# Altium schematic sheet Connecteurs.SchDoc
size A4
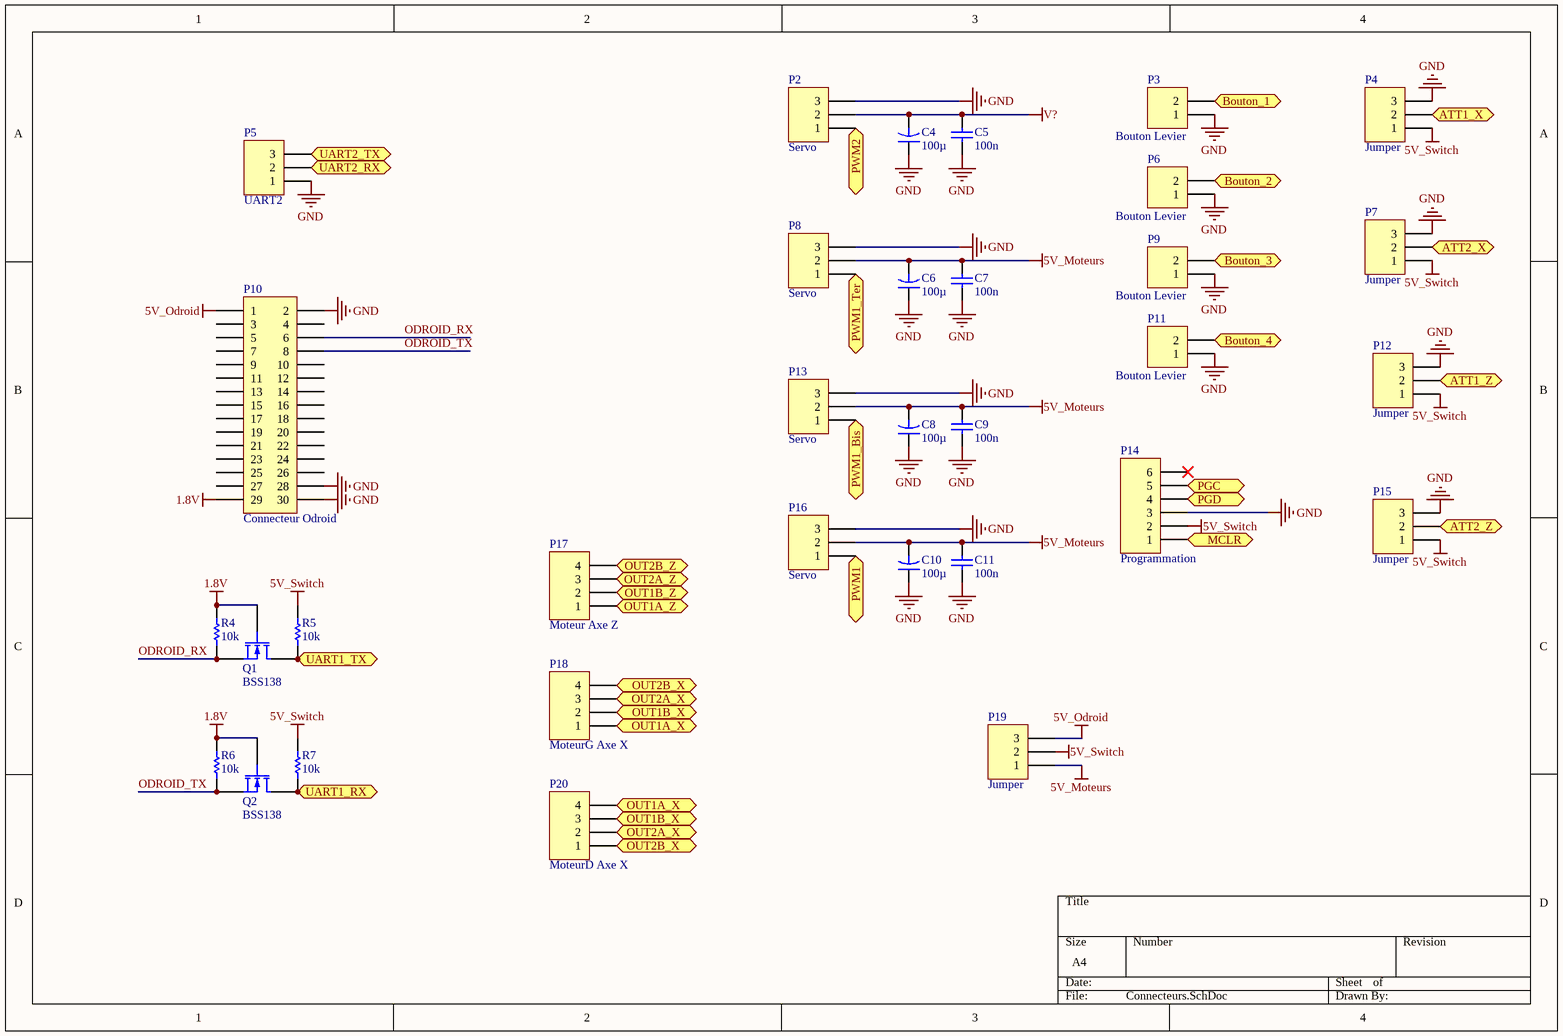
[diagram p0: Connecteurs.SchDoc]

## Parts
C4  value 100µ  [CAPR5-4X5]  (hidden comment: Cap2)
C5  value 100n  [RAD-0.3]  (hidden comment: Cap)
C6  value 100µ  [CAPR5-4X5]  (hidden comment: Cap2)
C7  value 100n  [RAD-0.3]  (hidden comment: Cap)
C8  value 100µ  [CAPR5-4X5]  (hidden comment: Cap2)
C9  value 100n  [RAD-0.3]  (hidden comment: Cap)
C10  value 100µ  [CAPR5-4X5]  (hidden comment: Cap2)
C11  value 100n  [RAD-0.3]  (hidden comment: Cap)
P2  Servo  [HDR1X3]
P3  Bouton Levier  [HDR1X2]
P4  Jumper  [HDR1X3]
P5  UART2  [HDR1X3]
P6  Bouton Levier  [HDR1X2]
P7  Jumper  [HDR1X3]
P8  Servo  [HDR1X3]
P9  Bouton Levier  [HDR1X2]
P10  Connecteur Odroid  [HDR2X15]
P11  Bouton Levier  [HDR1X2]
P12  Jumper  [HDR1X3]
P13  Servo  [HDR1X3]
P14  Programmation  [HDR1X6]
P15  Jumper  [HDR1X3]
P16  Servo  [HDR1X3]
P17  Moteur Axe Z  [HDR1X4]
P18  MoteurG Axe X  [HDR1X4]
P19  Jumper  [HDR1X3]
P20  MoteurD Axe X  [HDR1X4]
Q1  BSS138  [E3]
Q2  BSS138  [E3]
R4  value 10k  [AXIAL-0.3]  (hidden comment: Res1)
R5  value 10k  [AXIAL-0.3]  (hidden comment: Res1)
R6  value 10k  [AXIAL-0.3]  (hidden comment: Res1)
R7  value 10k  [AXIAL-0.3]  (hidden comment: Res1)

## Ports
ATT1_X, ATT1_Z, ATT2_X, ATT2_Z, Bouton_1, Bouton_2, Bouton_3, Bouton_4, MCLR, OUT1A_X, OUT1A_Z, OUT1B_X, OUT1B_Z, OUT2A_X, OUT2A_Z, OUT2B_X, OUT2B_Z, PGC, PGD, PWM1, PWM1_Bis, PWM1_Ter, PWM2, UART1_RX, UART1_TX, UART2_RX, UART2_TX

## Nets
1.8V: P10.29 Q1.2(G) Q2.2(G) R4.1 R6.1
5V_Moteurs: C6.2 C7.1 C8.2 C9.1 C10.2 C11.1 P8.2 P13.2 P16.2 P19.1
5V_Odroid: P10.1 P19.3
5V_Switch: P4.1 P7.1 P12.1 P14.2 P15.1 P19.2 R5.1 R7.1
GND: C4.1 C5.2 C6.1 C7.2 C8.1 C9.2 C10.1 C11.2 P2.3 P3.1 P4.3 P5.1 P6.1 P7.3 P8.3 P9.1 P10.2 P10.28 P10.30 P11.1 P12.3 P13.3 P14.3 P15.3 P16.3
V?: C4.2 C5.1 P2.2
ATT1_X: P4.2 ; port ATT1_X
ATT1_Z: P12.2 ; port ATT1_Z
ATT2_X: P7.2 ; port ATT2_X
ATT2_Z: P15.2 ; port ATT2_Z
Bouton_1: P3.2 ; port Bouton_1
Bouton_2: P6.2 ; port Bouton_2
Bouton_3: P9.2 ; port Bouton_3
Bouton_4: P11.2 ; port Bouton_4
MCLR: P14.1 ; port MCLR
ODROID_RX: P10.6 Q1.3(S) R4.2
ODROID_TX: P10.8 Q2.3(S) R6.2
OUT1A_X: P18.1 P20.4 ; port OUT1A_X
OUT1A_Z: P17.1 ; port OUT1A_Z
OUT1B_X: P18.2 P20.3 ; port OUT1B_X
OUT1B_Z: P17.2 ; port OUT1B_Z
OUT2A_X: P18.3 P20.2 ; port OUT2A_X
OUT2A_Z: P17.3 ; port OUT2A_Z
OUT2B_X: P18.4 P20.1 ; port OUT2B_X
OUT2B_Z: P17.4 ; port OUT2B_Z
PGC: P14.5 ; port PGC
PGD: P14.4 ; port PGD
PWM1: P16.1 ; port PWM1
PWM1_Bis: P13.1 ; port PWM1_Bis
PWM1_Ter: P8.1 ; port PWM1_Ter
PWM2: P2.1 ; port PWM2
UART1_RX: Q2.1(D) R7.2 ; port UART1_RX
UART1_TX: Q1.1(D) R5.2 ; port UART1_TX
UART2_RX: P5.2 ; port UART2_RX
UART2_TX: P5.3 ; port UART2_TX

Not connected (* = marked no-connect by the designer): P10 3 4 5 7 9 10 11 12 13 14 15 16 17 18 19 20 21 22 23 24 25 26 27; P14 6*

## Library data of the parts
C4 C6 C8 C10 = Cap2: 100µ; Published: 23-Sep-2002; PackageReference: CAPR5-4X5; Publisher: Altium Limited
C5 C7 C9 C11 = Cap: 100n; Published: 8-Jun-2000; LatestRevisionDate: 17-Jul-2002; LatestRevisionNote: Re-released for DXP Platform.; PackageReference: RAD-0.3; Publisher: Altium Limited
P2 P4 P5 P7 P8 P12 P13 P15 P16 P19 = Header 3: Header, 3-Pin; LatestRevisionDate: 17-Jul-2002; LatestRevisionNote: Re-released for DXP Platform.; Publisher: Altium Limited
P3 P6 P9 P11 = Header 2: Header, 2-Pin; LatestRevisionDate: 17-Jul-2002; LatestRevisionNote: Re-released for DXP Platform.; Publisher: Altium Limited
P10 = Header 15X2: Header, 15-Pin, Dual row; LatestRevisionDate: 17-Jul-2002; LatestRevisionNote: Re-released for DXP Platform.; Publisher: Altium Limited
P14 = Header 6: Header, 6-Pin; LatestRevisionDate: 17-Jul-2002; LatestRevisionNote: Re-released for DXP Platform.; Publisher: Altium Limited
P17 P18 P20 = Header 4: Header, 4-Pin; LatestRevisionDate: 17-Jul-2002; LatestRevisionNote: Re-released for DXP Platform.; Publisher: Altium Limited
Q1 Q2 = MOSFET-N: N-Channel MOSFET; Published: 8-Jun-2000; LatestRevisionDate: 17-Jul-2002; LatestRevisionNote: Re-released for DXP Platform.; PackageVersion: 1995/1996; PackageReference: E3; Publisher: Altium Limited; PackageDescription: TO, Flat Index; 3 In-Line, Axial Leads; Body Dia. 4.6mm; Lead Dia. 0.5 mm (max)
R4-R7 = Res1: 10k; Published: 8-Jun-2000; LatestRevisionDate: 17-Jul-2002; LatestRevisionNote: Re-released for DXP Platform.; PackageReference: AXIAL-0.3; Publisher: Altium Limited